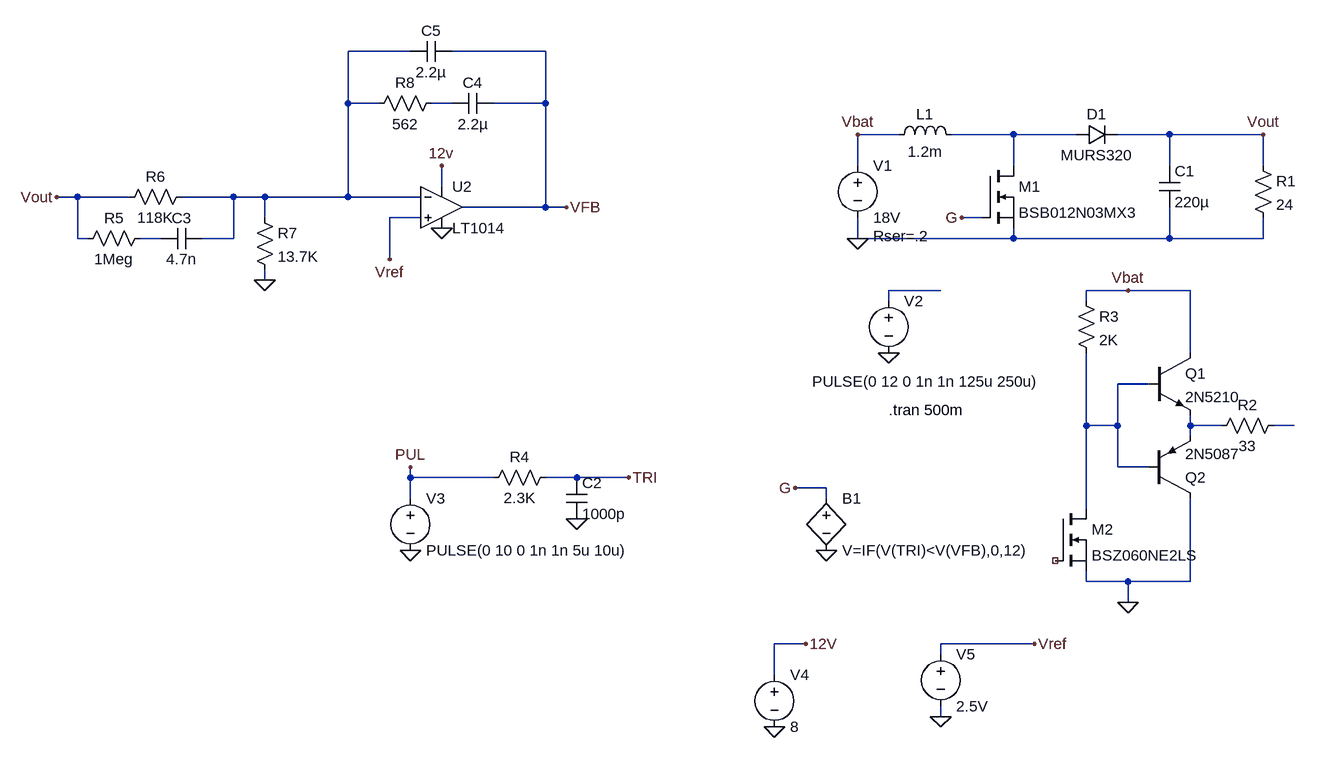
[diagram p0: schematic Boost_test1.asc]
Boost_test1.asc, the LTspice schematic file:
Version 4
SHEET 1 880 980
WIRE -688 -80 -784 -80
WIRE -480 -80 -624 -80
WIRE -784 0 -784 -80
WIRE -736 0 -784 0
WIRE -624 0 -656 0
WIRE -480 0 -480 -80
WIRE -480 0 -560 0
WIRE 64 48 0 48
WIRE 240 48 144 48
WIRE 336 48 240 48
WIRE 480 48 400 48
WIRE 624 48 480 48
WIRE 0 96 0 48
WIRE 240 96 240 48
WIRE 480 96 480 48
WIRE 624 96 624 48
WIRE -640 128 -640 96
WIRE -1200 144 -1232 144
WIRE -1120 144 -1200 144
WIRE -960 144 -1040 144
WIRE -912 144 -960 144
WIRE -784 144 -784 0
WIRE -784 144 -912 144
WIRE -672 144 -784 144
WIRE -480 160 -480 0
WIRE -480 160 -608 160
WIRE -448 160 -480 160
WIRE -912 176 -912 144
WIRE -672 176 -720 176
WIRE 192 176 160 176
WIRE -1200 208 -1200 144
WIRE -1184 208 -1200 208
WIRE -1072 208 -1104 208
WIRE -960 208 -960 144
WIRE -960 208 -1008 208
WIRE 0 208 0 176
WIRE 240 208 240 192
WIRE 240 208 0 208
WIRE 480 208 480 160
WIRE 480 208 240 208
WIRE 624 208 624 176
WIRE 624 208 480 208
WIRE -720 240 -720 176
WIRE -912 272 -912 256
WIRE 128 288 48 288
WIRE 416 288 352 288
WIRE 512 288 416 288
WIRE 48 304 48 288
WIRE 352 304 352 288
WIRE 512 384 512 288
WIRE 448 432 400 432
WIRE 352 496 352 384
WIRE 400 496 400 432
WIRE 400 496 352 496
WIRE 512 496 512 480
WIRE 560 496 512 496
WIRE 672 496 640 496
WIRE 512 512 512 496
WIRE 400 560 400 496
WIRE 448 560 400 560
WIRE -688 576 -688 560
WIRE -560 576 -688 576
WIRE -432 576 -480 576
WIRE -352 576 -432 576
WIRE -48 592 -96 592
WIRE -688 608 -688 576
WIRE -48 608 -48 592
WIRE 352 624 352 496
WIRE 352 736 352 720
WIRE 416 736 352 736
WIRE 512 736 512 608
WIRE 512 736 416 736
WIRE 416 768 416 736
WIRE -80 832 -128 832
WIRE 272 832 128 832
WIRE 128 848 128 832
WIRE -128 880 -128 832
WIRE 128 944 128 928
FLAG 0 208 0
FLAG 48 384 0
FLAG 0 48 Vbat
FLAG 416 288 Vbat
FLAG 416 768 0
FLAG -688 688 0
FLAG -432 640 0
FLAG -128 960 0
FLAG -80 832 12V
FLAG -720 240 Vref
FLAG -640 96 12v
FLAG -640 192 0
FLAG 624 48 Vout
FLAG -1232 144 Vout
FLAG -912 272 0
FLAG -448 160 VFB
FLAG -96 592 G
FLAG -48 688 0
FLAG -352 576 TRI
FLAG 272 832 Vref
FLAG -688 560 PUL
FLAG 160 176 G
FLAG 128 944 0
DATAFLAG 256 832 ""
SYMBOL voltage 0 80 R0
WINDOW 123 0 0 Left 0
WINDOW 39 24 124 Left 2
SYMATTR SpiceLine Rser=.2
SYMATTR InstName V1
SYMATTR Value 18V
SYMBOL ind 48 64 R270
WINDOW 0 32 56 VTop 2
WINDOW 3 5 56 VBottom 2
SYMATTR InstName L1
SYMATTR Value 1.2m
SYMATTR SpiceLine Rser=.2
SYMBOL diode 336 64 R270
WINDOW 0 32 32 VTop 2
WINDOW 3 0 32 VBottom 2
SYMATTR InstName D1
SYMATTR Value MURS320
SYMBOL cap 464 96 R0
SYMATTR InstName C1
SYMATTR Value 220µ
SYMBOL res 608 80 R0
SYMATTR InstName R1
SYMATTR Value 24
SYMBOL voltage 48 288 R0
WINDOW 123 0 0 Left 0
WINDOW 39 0 0 Left 0
WINDOW 3 -118 140 Left 2
SYMATTR Value PULSE(0 12 0 1n 1n 125u 250u)
SYMATTR InstName V2
SYMBOL npn 448 384 R0
SYMATTR InstName Q1
SYMATTR Value 2N5210
SYMBOL pnp 448 608 M180
SYMATTR InstName Q2
SYMATTR Value 2N5087
SYMBOL res 656 480 R90
WINDOW 0 0 56 VBottom 2
WINDOW 3 32 56 VTop 2
SYMATTR InstName R2
SYMATTR Value 33
SYMBOL res 336 288 R0
SYMATTR InstName R3
SYMATTR Value 2K
SYMBOL nmos 304 624 R0
SYMATTR InstName M2
SYMATTR Value BSZ060NE2LS
SYMBOL voltage -688 592 R0
WINDOW 123 0 0 Left 0
WINDOW 39 0 0 Left 0
SYMATTR InstName V3
SYMATTR Value PULSE(0 10 0 1n 1n 5u 10u)
SYMBOL res -464 560 R90
WINDOW 0 0 56 VBottom 2
WINDOW 3 32 56 VTop 2
SYMATTR InstName R4
SYMATTR Value 2.3K
SYMBOL cap -448 576 R0
SYMATTR InstName C2
SYMATTR Value 1000p
SYMBOL voltage -128 864 R0
WINDOW 123 0 0 Left 0
WINDOW 39 0 0 Left 0
SYMATTR InstName V4
SYMATTR Value 8
SYMBOL Opamps\\LT1014 -640 96 R0
SYMATTR InstName U2
SYMBOL res -1088 192 R90
WINDOW 0 0 56 VBottom 2
WINDOW 3 32 56 VTop 2
SYMATTR InstName R5
SYMATTR Value 1Meg
SYMBOL res -1024 128 R90
WINDOW 0 0 56 VBottom 2
WINDOW 3 32 56 VTop 2
SYMATTR InstName R6
SYMATTR Value 118K
SYMBOL cap -1008 192 R90
WINDOW 0 0 32 VBottom 2
WINDOW 3 32 32 VTop 2
SYMATTR InstName C3
SYMATTR Value 4.7n
SYMBOL res -928 160 R0
SYMATTR InstName R7
SYMATTR Value 13.7K
SYMBOL res -640 -16 R90
WINDOW 0 0 56 VBottom 2
WINDOW 3 32 56 VTop 2
SYMATTR InstName R8
SYMATTR Value 562
SYMBOL cap -560 -16 R90
WINDOW 0 0 32 VBottom 2
WINDOW 3 32 32 VTop 2
SYMATTR InstName C4
SYMATTR Value 2.2µ
SYMBOL cap -624 -96 R90
WINDOW 0 0 32 VBottom 2
WINDOW 3 32 32 VTop 2
SYMATTR InstName C5
SYMATTR Value 2.2µ
SYMBOL bv -48 592 R0
SYMATTR InstName B1
SYMATTR Value V=IF(V(TRI)<V(VFB),0,12)
SYMBOL voltage 128 832 R0
WINDOW 123 0 0 Left 0
WINDOW 39 0 0 Left 0
SYMATTR InstName V5
SYMATTR Value 2.5V
SYMBOL nmos 192 96 R0
SYMATTR InstName M1
SYMATTR Value BSB012N03MX3
TEXT 48 472 Left 2 !.tran 500m

The netlist it stands for:
* Boost_test1.asc
V1 Vbat 0 18V Rser=.2
L1 Vbat N003 1.2m Rser=.2
D1 N003 Vout MURS320
C1 Vout 0 220µ
R1 Vout 0 24
V2 N005 0 PULSE(0 12 0 1n 1n 125u 250u)
Q1 Vbat N006 N007 0 2N5210
Q2 0 N006 N007 0 2N5087
R2 N008 N007 33
R3 Vbat N006 2K
M2 N006 NC_01 0 0 BSZ060NE2LS
V3 PUL 0 PULSE(0 10 0 1n 1n 5u 10u)
R4 TRI PUL 2.3K
C2 TRI 0 1000p
V4 12V 0 8
XU2 Vref N001 12V 0 VFB LT1014  ; pins In+ In- V+ V- OUT
R5 N004 Vout 1Meg
R6 N001 Vout 118K
C3 N001 N004 4.7n
R7 N001 0 13.7K
R8 N002 N001 562
C4 VFB N002 2.2µ
C5 VFB N001 2.2µ
B1 G 0 V=IF(V(TRI)<V(VFB),0,12)
V5 Vref 0 2.5V
M1 N003 G 0 0 BSB012N03MX3
.model D D
.lib standard.dio
.model NPN NPN
.model PNP PNP
.lib standard.bjt
.model NMOS NMOS
.model PMOS PMOS
.lib standard.mos
.tran 500m
.backanno
.end